# Altium schematic sheet 03-MCU.SchDoc: MCU
size A2; DocumentNumber: 3; SheetNumber: 3; SheetTotal: 15
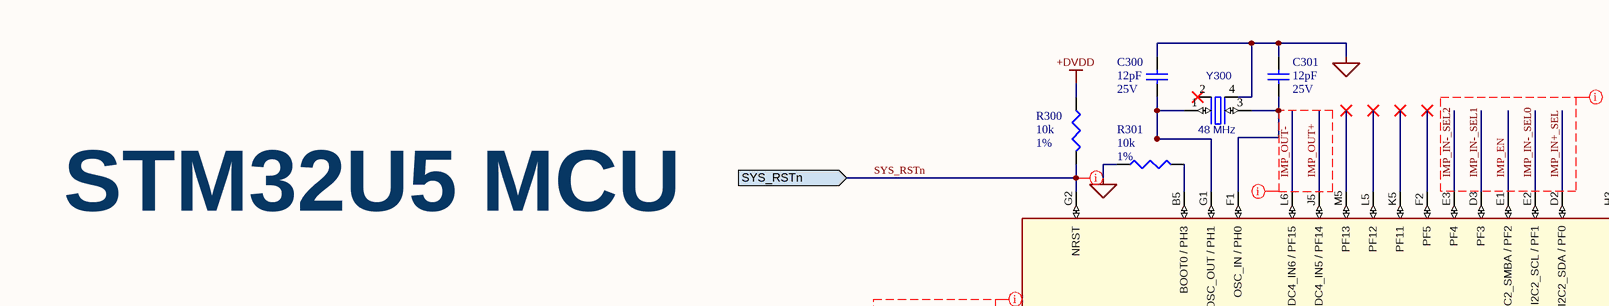
[diagram p0: 03-MCU.SchDoc, top left]
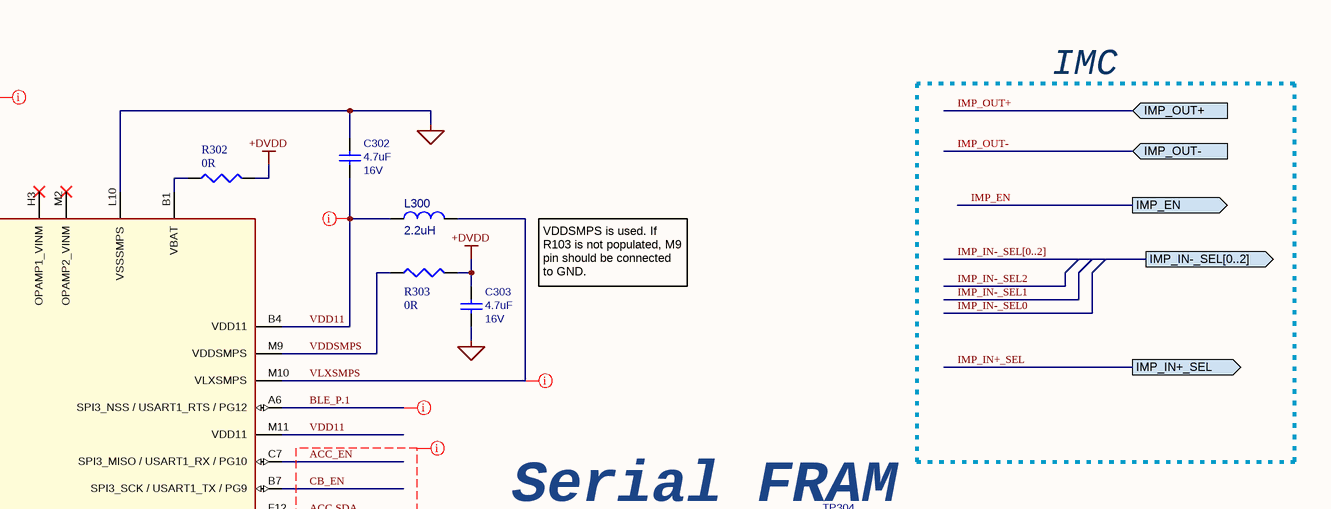
[diagram p1: 03-MCU.SchDoc, top right]
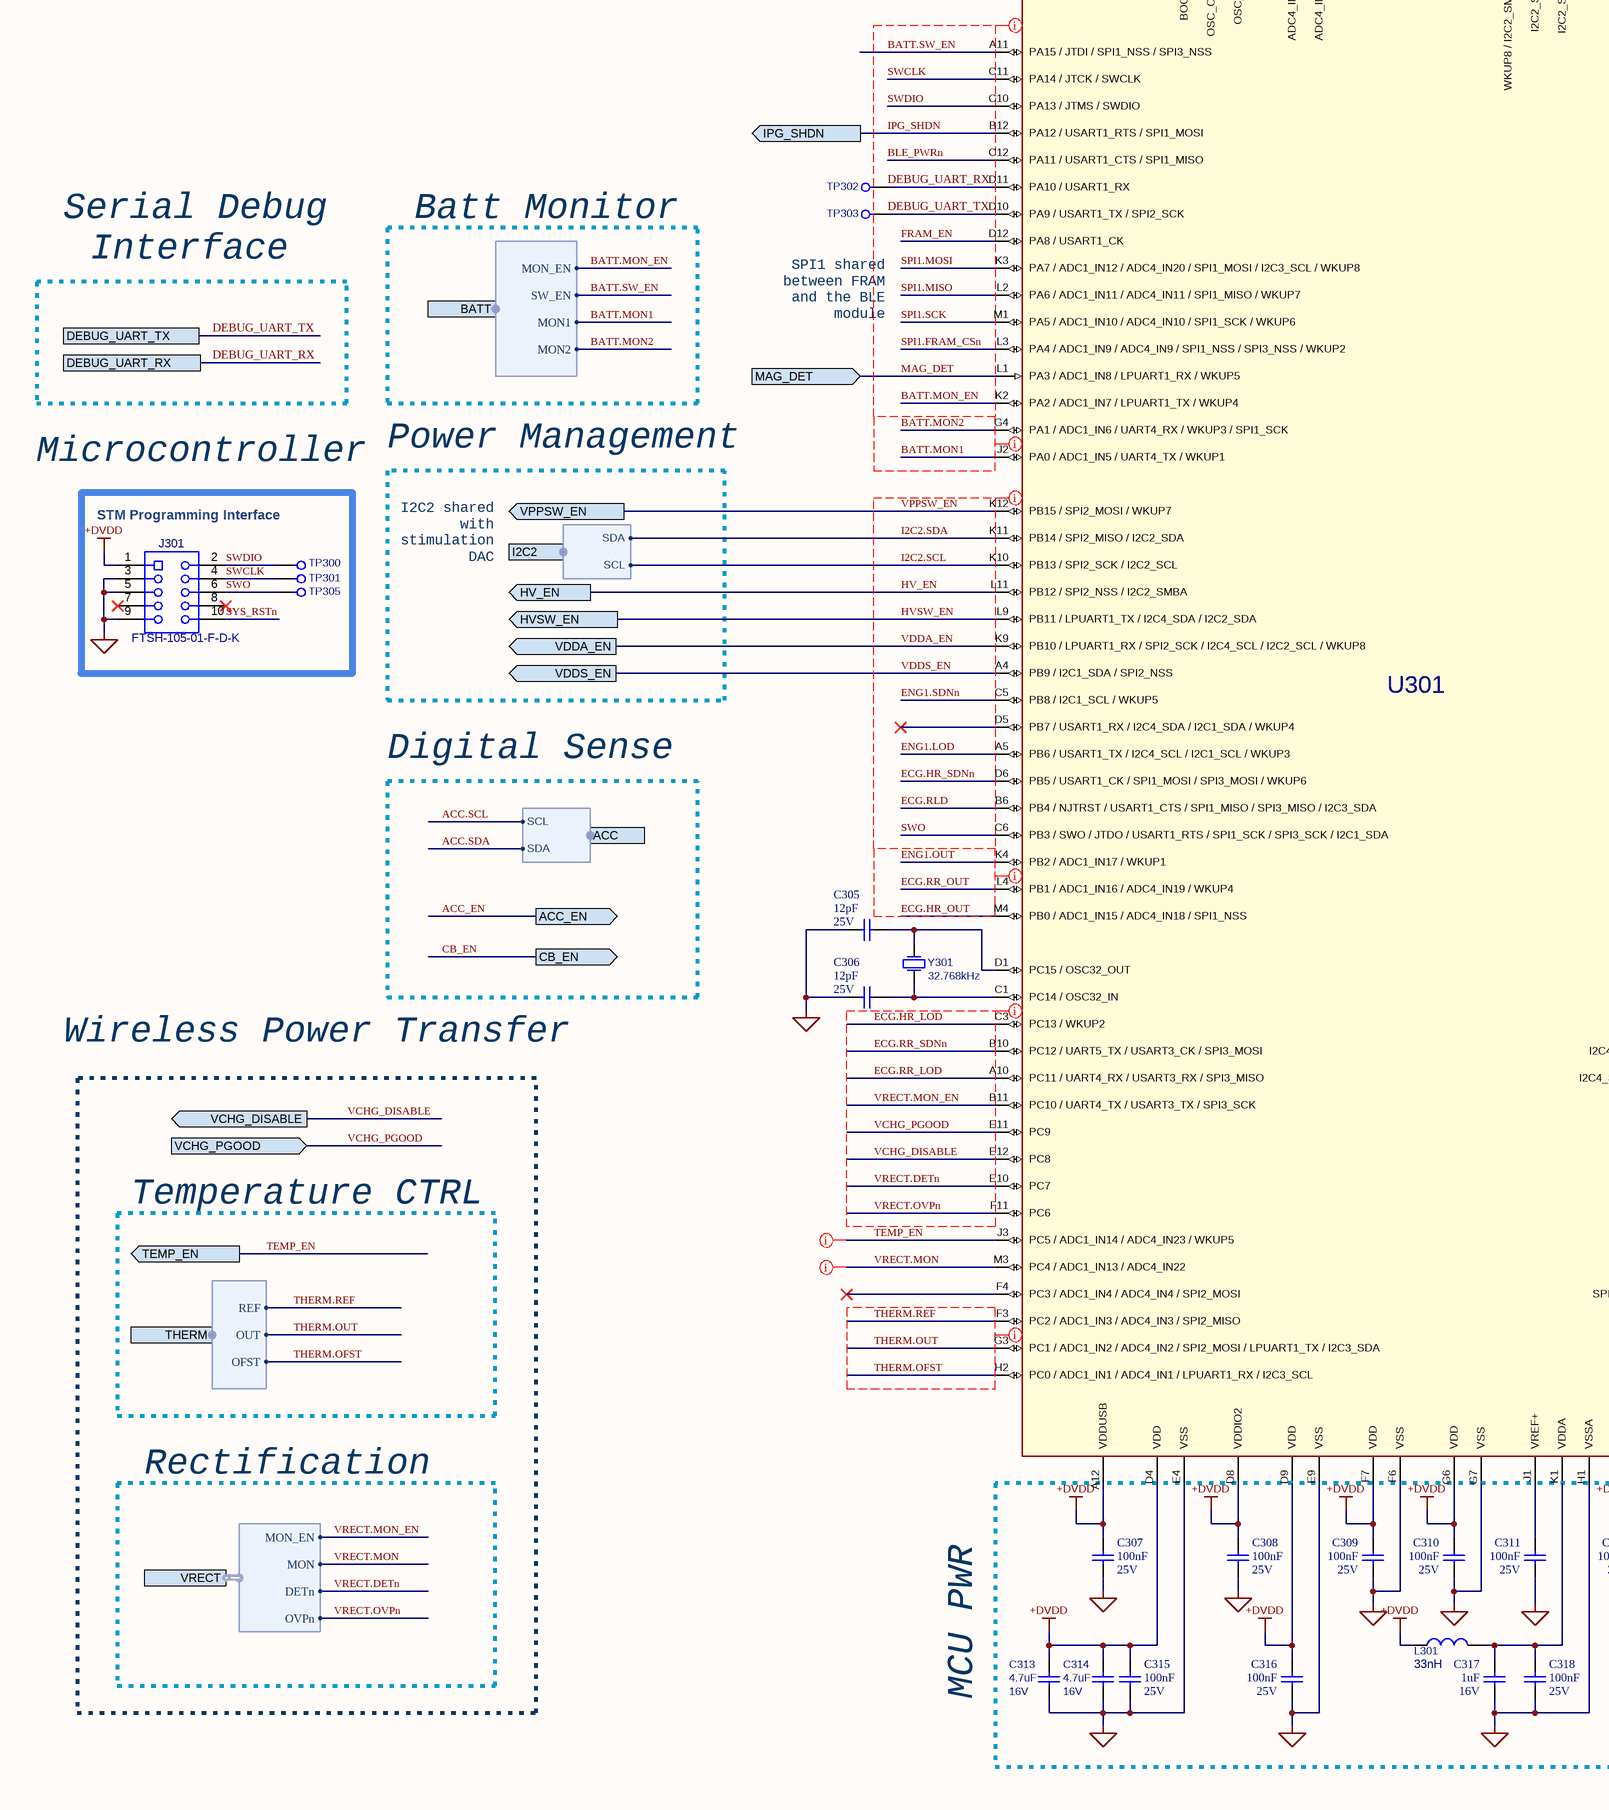
[diagram p2: 03-MCU.SchDoc, bottom left]
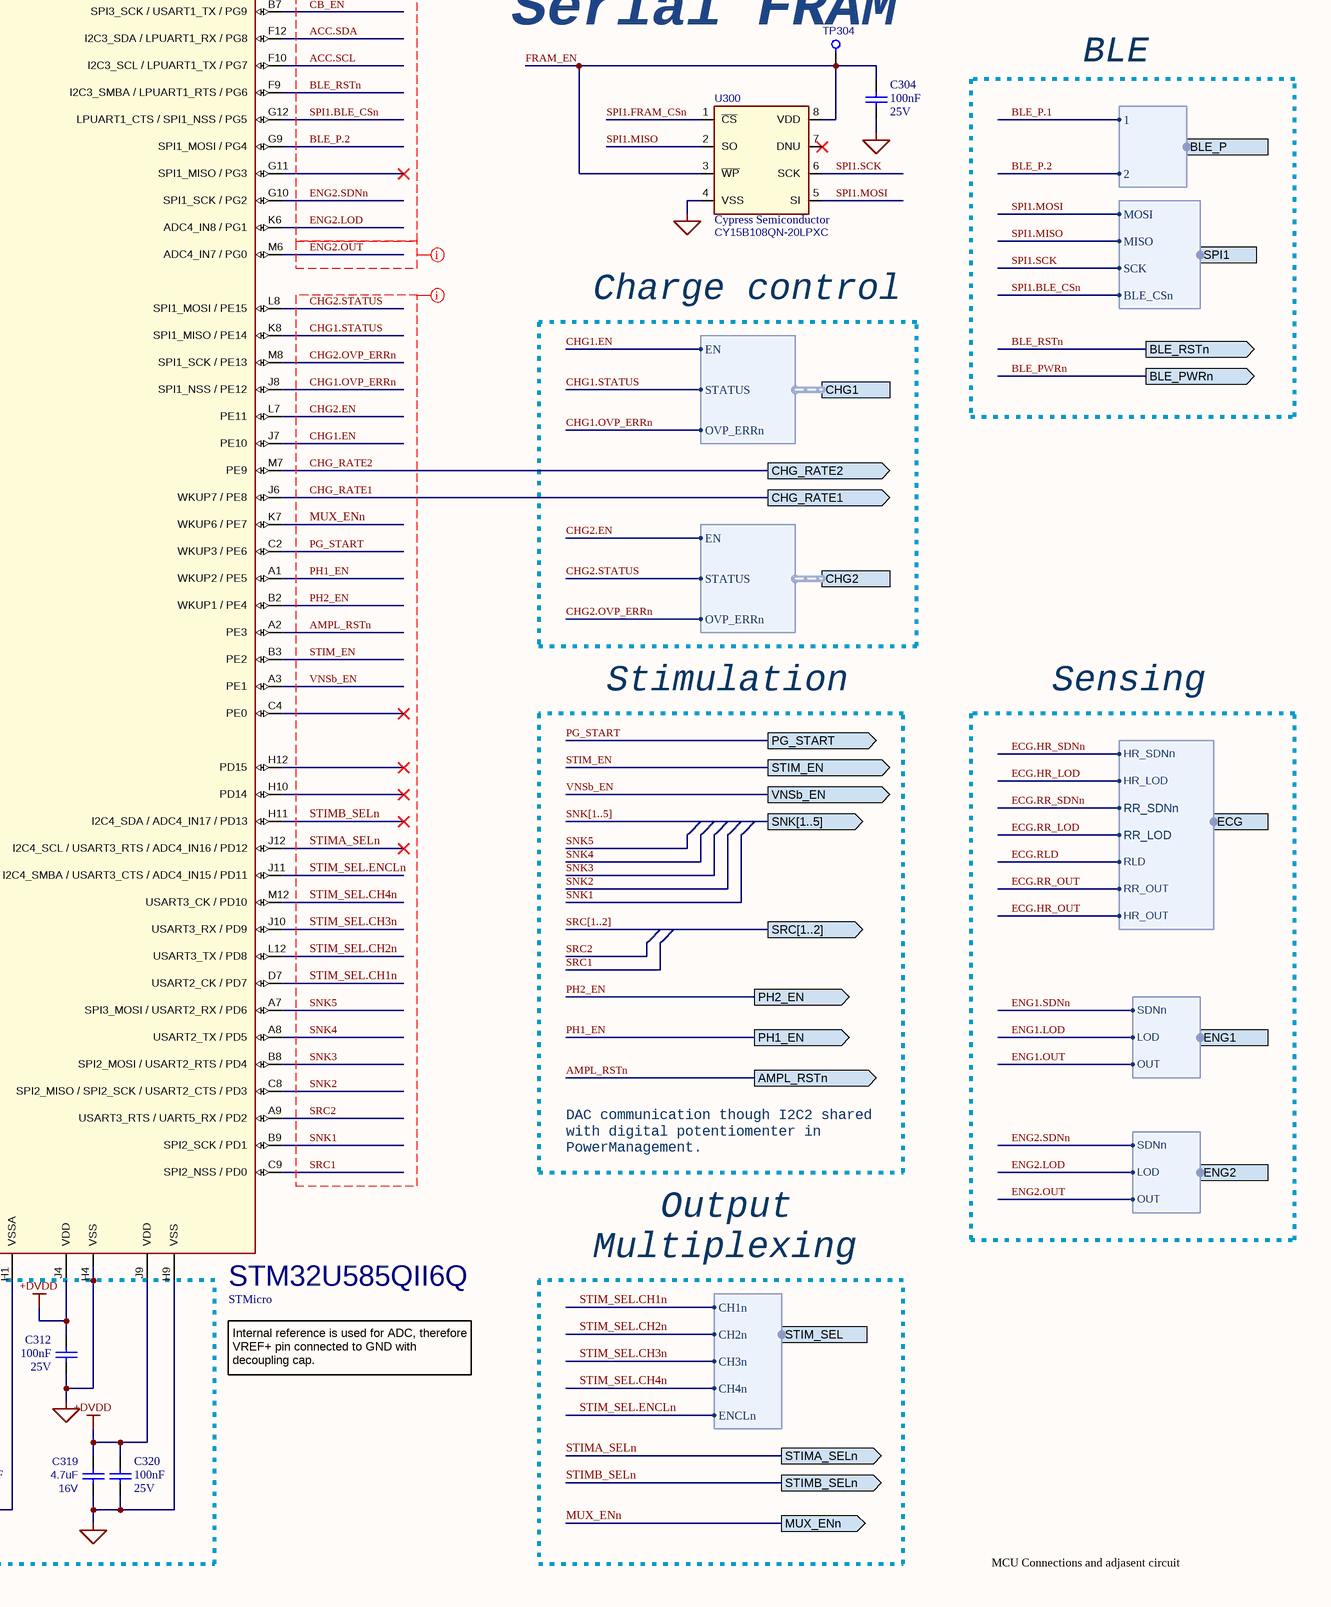
[diagram p3: 03-MCU.SchDoc, bottom right]

## Parts
C300  value 12pF  Rated DC Voltage (URdc): 25V  [C0201_C]  (hidden comment: GRM0335C1E120JA01D)
C301  value 12pF  Rated DC Voltage (URdc): 25V  [C0201_C]  (hidden comment: GRM0335C1E120JA01D)
C302  value 4.7uF  Rating: 16V  [CAP0603_REDUCED]  (hidden comment: GRM188R61C475KE11)
C303  value 4.7uF  Rating: 16V  [CAP0603_REDUCED]  (hidden comment: GRM188R61C475KE11)
C304  value 100nF  Rated DC Voltage (URdc): 25V  [C0201_C]  (hidden comment: GRM033R61E104KE14J)
C305  value 12pF  Rated DC Voltage (URdc): 25V  [C0201_C]  (hidden comment: GRM0335C1E120JA01D)
C306  value 12pF  Rated DC Voltage (URdc): 25V  [C0201_C]  (hidden comment: GRM0335C1E120JA01D)
C307  value 100nF  Rated DC Voltage (URdc): 25V  [C0201_C]  (hidden comment: GRM033R61E104KE14J)
C308  value 100nF  Rated DC Voltage (URdc): 25V  [C0201_C]  (hidden comment: GRM033R61E104KE14J)
C309  value 100nF  Rated DC Voltage (URdc): 25V  [C0201_C]  (hidden comment: GRM033R61E104KE14J)
C310  value 100nF  Rated DC Voltage (URdc): 25V  [C0201_C]  (hidden comment: GRM033R61E104KE14J)
C311  value 100nF  Rated DC Voltage (URdc): 25V  [C0201_C]  (hidden comment: GRM033R61E104KE14J)
C312  value 100nF  Rated DC Voltage (URdc): 25V  [C0201_C]  (hidden comment: GRM033R61E104KE14J)
C313  value 4.7uF  Rating: 16V  [CAP0603_REDUCED]  (hidden comment: GRM188R61C475KE11)
C314  value 4.7uF  Rating: 16V  [CAP0603_REDUCED]  (hidden comment: GRM188R61C475KE11)
C315  value 100nF  Rated DC Voltage (URdc): 25V  [C0201_C]  (hidden comment: GRM033R61E104KE14J)
C316  value 100nF  Rated DC Voltage (URdc): 25V  [C0201_C]  (hidden comment: GRM033R61E104KE14J)
C317  value 1uF  Rated DC Voltage (URdc): 16V  [C0201_C]  (hidden comment: GRM033R61C105ME15D)
C318  value 100nF  Rated DC Voltage (URdc): 25V  [C0201_C]  (hidden comment: GRM033R61E104KE14J)
C319  value 4.7uF  Rating: 16V  [CAP0603_REDUCED]  (hidden comment: GRM188R61C475KE11)
C320  value 100nF  Rated DC Voltage (URdc): 25V  [C0201_C]  (hidden comment: GRM033R61E104KE14J)
J301  FTSH-105-01-F-D-K  [SAMTEC_FTSH-105-01-XXX-D-K]
L300  value 2.2uH  [TDK_VLS252010HBX-1]  (hidden comment: VLS252010HBX-2R2M-1)
L301  value 33nH  [L0402_C]  (hidden comment: LQG15HS33NJ02D)
R300  value 10k  Tolerance: 1%  [R0201_C]  (hidden comment: CRCW020110K0FNED)
R301  value 10k  Tolerance: 1%  [R0201_C]  (hidden comment: CRCW020110K0FNED)
R302  value 0R  [R0201_C]  (hidden comment: CRCW02010000Z0ED)
R303  value 0R  [R0201_C]  (hidden comment: CRCW02010000Z0ED)
TP300  Test Point  [testpad_0.9mm]  (value not drawn)  (no BOM)
TP301  Test Point  [testpad_0.9mm]  (value not drawn)  (no BOM)
TP302  Test Point  [testpad_0.9mm]  (value not drawn)  (no BOM)
TP303  Test Point  [testpad_0.9mm]  (value not drawn)  (no BOM)
TP304  Test Point  [testpad_0.9mm]  (value not drawn)  (no BOM)
TP305  Test Point  [testpad_0.9mm]  (value not drawn)  (no BOM)
U300  Manufacturer: Cypress Semiconductor  [CY_002-18131_GQFN8]  (hidden comment: CY15B108QN-20LPXC)
U301  Manufacturer: STMicro  [STM_UFBGA132]  (hidden comment: STM32U585QII6Q)
Y300  value 48 MHz  [XTAL_ECS-SMD-CRYSTAL-10-48-CKY-TR]  (hidden comment: ECS-480-10-48-CKY-TR)
Y301  value 32.768kHz  [MICROCRYSTAL_CC8V-T1A]  (hidden comment: CM8V-T1A-32.768KHZ-6PF-20PPM-TA-QC)

## Ports
ACC (harness I2C), ACC_EN (out), AMPL_RSTn (out), BATT (harness BATT), BLE_P (harness BLE PINS), BLE_PWRn (out), BLE_RSTn (out), CB_EN (out), CHG1 (harness CHG_CTRL), CHG2 (harness CHG_CTRL), CHG_RATE1 (out), CHG_RATE2 (out), DEBUG_UART_RX, DEBUG_UART_TX, ECG (harness ECG), ENG1 (harness EMG), ENG2 (harness EMG), HV_EN (out), HVSW_EN (out), I2C2 (harness I2C), IMP_EN (out), IMP_IN+_SEL (out), IMP_IN-_SEL[0..2] (out), IMP_OUT+ (in), IMP_OUT- (in), IPG_SHDN (out), MAG_DET (in), MUX_ENn (out), PG_START (out), PH1_EN (out), PH2_EN (out), SNK[1..5] (out), SPI1 (harness BLE_SPI), SRC[1..2] (out), STIM_EN (out), STIM_SEL (in, harness STIM_SEL), STIMA_SELn (out), STIMB_SELn (out), SYS_RSTn (in), TEMP_EN (out), THERM (harness THERMAL CTRL), VCHG_DISABLE (out), VCHG_PGOOD (in), VDDA_EN (out), VDDS_EN (out), VNSb_EN (out), VPPSW_EN (out), VRECT (harness VRECT)

## Harnesses
BLE PINS: 1, 2
BLE_SPI: MOSI, MISO, BLE_CSn, SCK
BATT: MON_EN, SW_EN, MON1, MON2
CHG_CTRL: STATUS, OVP_ERRn, EN
I2C: SDA, SCL
ECG: HR_SDNn, RLD, HR_LOD, HR_OUT, RR_SDNn, RR_LOD, RR_OUT
THERMAL CTRL: REF, OUT, OFST
VRECT: OVPn, DETn, MON, MON_EN
EMG: SDNn, LOD, OUT
STIM_SEL: CH1n, CH2n, CH3n, CH4n, ENCLn

## Nets
+DVDD: C303.1 C307.2 C308.2 C309.2 C310.2 C312.2 C313.1 C314.1 C315.2 C316.2 C319.1 C320.2 J301.1 L301.1 R300.1 R302.2 R303.2 U301.A12(VDDUSB) U301.D4(VDD) U301.D8(VDDIO2) U301.D9(VDD) U301.F7(VDD) U301.G6(VDD) U301.J4(VDD) U301.J9(VDD)
GND: C300.1 C301.2 C302.1 C303.2 C304.1 C305.1 C306.1 C307.1 C308.1 C309.1 C310.1 C311.1 C312.1 C313.2 C314.2 C315.1 C316.1 C317.2 C318.1 C319.2 C320.1 J301.3 J301.5 J301.9 R301.1 U300.4(VSS) U301.E4(VSS) U301.E9(VSS) U301.F6(VSS) U301.G7(VSS) U301.H1(VSSA) U301.H4(VSS) U301.H9(VSS) U301.L10(VSSSMPS) Y300.4(GND)
ACC.SCL: U301.F10(I2C3_SCL_/_LPUART1_TX_/_PG7) ; port ACC.SCL
ACC.SDA: U301.F12(I2C3_SDA_/_LPUART1_RX_/_PG8) ; port ACC.SDA
ACC_EN: U301.C7(SPI3_MISO_/_USART1_RX_/_PG10) ; port ACC_EN
AMPL_RSTn: U301.A2(PE3) ; port AMPL_RSTn
BATT.MON1: U301.J2(PA0_/_ADC1_IN5_/_UART4_TX_/_WKUP1) ; port BATT.MON1
BATT.MON2: U301.G4(PA1_/_ADC1_IN6_/_UART4_RX_/_WKUP3_/_SPI1_SCK) ; port BATT.MON2
BATT.MON_EN: U301.K2(PA2_/_ADC1_IN7_/_LPUART1_TX_/_WKUP4) ; port BATT.MON_EN
BATT.SW_EN: U301.A11(PA15_/_JTDI_/_SPI1_NSS_/_SPI3_NSS) ; port BATT.SW_EN
BLE_P.1: U301.A6(SPI3_NSS_/_USART1_RTS_/_PG12) ; port BLE_P.1
BLE_P.2: U301.G9(SPI1_MOSI_/_PG4) ; port BLE_P.2
BLE_PWRn: U301.C12(PA11_/_USART1_CTS_/_SPI1_MISO) ; port BLE_PWRn
BLE_RSTn: U301.F9(I2C3_SMBA_/_LPUART1_RTS_/_PG6) ; port BLE_RSTn
CB_EN: U301.B7(SPI3_SCK_/_USART1_TX_/_PG9) ; port CB_EN
CHG1.EN: U301.J7(PE10) ; port CHG1.EN
CHG1.OVP_ERRn: U301.J8(SPI1_NSS_/_PE12) ; port CHG1.OVP_ERRn
CHG1.STATUS: U301.K8(SPI1_MISO_/_PE14) ; port CHG1.STATUS
CHG2.EN: U301.L7(PE11) ; port CHG2.EN
CHG2.OVP_ERRn: U301.M8(SPI1_SCK_/_PE13) ; port CHG2.OVP_ERRn
CHG2.STATUS: U301.L8(SPI1_MOSI_/_PE15) ; port CHG2.STATUS
CHG_RATE1: U301.J6(WKUP7_/_PE8) ; port CHG_RATE1
CHG_RATE2: U301.M7(PE9) ; port CHG_RATE2
DEBUG_UART_RX: TP302.1 U301.D11(PA10_/_USART1_RX) ; port DEBUG_UART_RX
DEBUG_UART_TX: TP303.1 U301.D10(PA9_/_USART1_TX_/_SPI2_SCK) ; port DEBUG_UART_TX
ECG.HR_LOD: U301.C3(PC13_/_WKUP2) ; port ECG.HR_LOD
ECG.HR_OUT: U301.M4(PB0_/_ADC1_IN15_/_ADC4_IN18_/_SPI1_NSS) ; port ECG.HR_OUT
ECG.HR_SDNn: U301.D6(PB5_/_USART1_CK_/_SPI1_MOSI_/_SPI3_MOSI_/_WKUP6) ; port ECG.HR_SDNn
ECG.RLD: U301.B6(PB4_/_NJTRST_/_USART1_CTS_/_SPI1_MISO_/_SPI3_MISO_/_I2C3_SDA) ; port ECG.RLD
ECG.RR_LOD: U301.A10(PC11_/_UART4_RX_/_USART3_RX_/_SPI3_MISO) ; port ECG.RR_LOD
ECG.RR_OUT: U301.L4(PB1_/_ADC1_IN16_/_ADC4_IN19_/_WKUP4) ; port ECG.RR_OUT
ECG.RR_SDNn: U301.B10(PC12_/_UART5_TX_/_USART3_CK_/_SPI3_MOSI) ; port ECG.RR_SDNn
ENG1.LOD: U301.A5(PB6_/_USART1_TX_/_I2C4_SCL_/_I2C1_SCL_/_WKUP3) ; port ENG1.LOD
ENG1.OUT: U301.K4(PB2_/_ADC1_IN17_/_WKUP1) ; port ENG1.OUT
ENG1.SDNn: U301.C5(PB8_/_I2C1_SCL_/_WKUP5) ; port ENG1.SDNn
ENG2.LOD: U301.K6(ADC4_IN8_/_PG1) ; port ENG2.LOD
ENG2.OUT: U301.M6(ADC4_IN7_/_PG0) ; port ENG2.OUT
ENG2.SDNn: U301.G10(SPI1_SCK_/_PG2) ; port ENG2.SDNn
FRAM_EN: C304.2 TP304.1 U300.3(~{WP}) U300.8(VDD) U301.D12(PA8_/_USART1_CK)
HV_EN: U301.L11(PB12_/_SPI2_NSS_/_I2C2_SMBA) ; port HV_EN
HVSW_EN: U301.L9(PB11_/_LPUART1_TX_/_I2C4_SDA_/_I2C2_SDA) ; port HVSW_EN
I2C2.SCL: U301.K10(PB13_/_SPI2_SCK_/_I2C2_SCL) ; port I2C2.SCL
I2C2.SDA: U301.K11(PB14_/_SPI2_MISO_/_I2C2_SDA) ; port I2C2.SDA
IMP_EN: U301.E1(WKUP8_/_I2C2_SMBA_/_PF2) ; port IMP_EN
IMP_IN+_SEL: U301.D2(I2C2_SDA_/_PF0) ; port IMP_IN+_SEL
IMP_IN-_SEL0: U301.E2(I2C2_SCL_/_PF1)
IMP_IN-_SEL1: U301.D3(PF3)
IMP_IN-_SEL2: U301.E3(PF4)
IMP_OUT+: U301.J5(ADC4_IN5_/_PF14) ; port IMP_OUT+
IMP_OUT-: U301.L6(ADC4_IN6_/_PF15) ; port IMP_OUT-
IPG_SHDN: U301.B12(PA12_/_USART1_RTS_/_SPI1_MOSI) ; port IPG_SHDN
MAG_DET: U301.L1(PA3_/_ADC1_IN8_/_LPUART1_RX_/_WKUP5) ; port MAG_DET
MUX_ENn: U301.K7(WKUP6_/_PE7) ; port MUX_ENn
PG_START: U301.C2(WKUP3_/_PE6) ; port PG_START
PH1_EN: U301.A1(WKUP2_/_PE5) ; port PH1_EN
PH2_EN: U301.B2(WKUP1_/_PE4) ; port PH2_EN
SNK1: U301.B9(SPI2_SCK_/_PD1)
SNK2: U301.C8(SPI2_MISO_/_SPI2_SCK_/_USART2_CTS_/_PD3)
SNK3: U301.B8(SPI2_MOSI_/_USART2_RTS_/_PD4)
SNK4: U301.A8(USART2_TX_/_PD5)
SNK5: U301.A7(SPI3_MOSI_/_USART2_RX_/_PD6)
SPI1.BLE_CSn: U301.G12(LPUART1_CTS_/_SPI1_NSS_/_PG5) ; port SPI1.BLE_CSn
SPI1.FRAM_CSn: U300.1(~{CS}) U301.L3(PA4_/_ADC1_IN9_/_ADC4_IN9_/_SPI1_NSS_/_SPI3_NSS_/_WKUP2)
SPI1.MISO: U300.2(SO) U301.L2(PA6_/_ADC1_IN11_/_ADC4_IN11_/_SPI1_MISO_/_WKUP7) ; port SPI1.MISO
SPI1.MOSI: U300.5(SI) U301.K3(PA7_/_ADC1_IN12_/_ADC4_IN20_/_SPI1_MOSI_/_I2C3_SCL_/_WKUP8) ; port SPI1.MOSI
SPI1.SCK: U300.6(SCK) U301.M1(PA5_/_ADC1_IN10_/_ADC4_IN10_/_SPI1_SCK_/_WKUP6) ; port SPI1.SCK
SRC1: U301.C9(SPI2_NSS_/_PD0)
SRC2: U301.A9(USART3_RTS_/_UART5_RX_/_PD2)
STIM_EN: U301.B3(PE2) ; port STIM_EN
STIM_SEL.CH1n: U301.D7(USART2_CK_/_PD7) ; port STIM_SEL.CH1n
STIM_SEL.CH2n: U301.L12(USART3_TX_/_PD8) ; port STIM_SEL.CH2n
STIM_SEL.CH3n: U301.J10(USART3_RX_/_PD9) ; port STIM_SEL.CH3n
STIM_SEL.CH4n: U301.M12(USART3_CK_/_PD10) ; port STIM_SEL.CH4n
STIM_SEL.ENCLn: U301.J11(I2C4_SMBA_/_USART3_CTS_/_ADC4_IN15_/_PD11) ; port STIM_SEL.ENCLn
STIMA_SELn: U301.J12(I2C4_SCL_/_USART3_RTS_/_ADC4_IN16_/_PD12) ; port STIMA_SELn
STIMB_SELn: U301.H11(I2C4_SDA_/_ADC4_IN17_/_PD13) ; port STIMB_SELn
SWCLK: J301.4 TP301.1 U301.C11(PA14_/_JTCK_/_SWCLK)
SWDIO: J301.2 TP300.1 U301.C10(PA13_/_JTMS_/_SWDIO)
SWO: J301.6 TP305.1 U301.C6(PB3_/_SWO_/_JTDO_/_USART1_RTS_/_SPI1_SCK_/_SPI3_SCK_/_I2C1_SDA)
SYS_RSTn: J301.10 R300.2 U301.G2(NRST) ; port SYS_RSTn
TEMP_EN: U301.J3(PC5_/_ADC1_IN14_/_ADC4_IN23_/_WKUP5) ; port TEMP_EN
THERM.OFST: U301.H2(PC0_/_ADC1_IN1_/_ADC4_IN1_/_LPUART1_RX_/_I2C3_SCL) ; port THERM.OFST
THERM.OUT: U301.G3(PC1_/_ADC1_IN2_/_ADC4_IN2_/_SPI2_MOSI_/_LPUART1_TX_/_I2C3_SDA) ; port THERM.OUT
THERM.REF: U301.F3(PC2_/_ADC1_IN3_/_ADC4_IN3_/_SPI2_MISO) ; port THERM.REF
VCHG_DISABLE: U301.E12(PC8) ; port VCHG_DISABLE
VCHG_PGOOD: U301.E11(PC9) ; port VCHG_PGOOD
VDD11: C302.2 L300.1 U301.B4(VDD11) U301.M11(VDD11)
VDDA_EN: U301.K9(PB10_/_LPUART1_RX_/_SPI2_SCK_/_I2C4_SCL_/_I2C2_SCL_/_WKUP8) ; port VDDA_EN
VDDS_EN: U301.A4(PB9_/_I2C1_SDA_/_SPI2_NSS) ; port VDDS_EN
VDDSMPS: R303.1 U301.M9(VDDSMPS)
VLXSMPS: L300.2 U301.M10(VLXSMPS)
VNSb_EN: U301.A3(PE1) ; port VNSb_EN
VPPSW_EN: U301.K12(PB15_/_SPI2_MOSI_/_WKUP7) ; port VPPSW_EN
VRECT.DETn: U301.E10(PC7) ; port VRECT.DETn
VRECT.MON: U301.M3(PC4_/_ADC1_IN13_/_ADC4_IN22) ; port VRECT.MON
VRECT.MON_EN: U301.B11(PC10_/_UART4_TX_/_USART3_TX_/_SPI3_SCK) ; port VRECT.MON_EN
VRECT.OVPn: U301.F11(PC6) ; port VRECT.OVPn
NetC300_2: C300.2 U301.G1(OSC_OUT_/_PH1) Y300.1(IN/OUT)
NetC301_1: C301.1 U301.F1(OSC_IN_/_PH0) Y300.3(OUT/IN)
NetC305_2: C305.2 U301.D1(PC15_/_OSC32_OUT) Y301.2
NetC306_2: C306.2 U301.C1(PC14_/_OSC32_IN) Y301.1
NetC311_2: C311.2 U301.J1(VREF+)
NetC317_1: C317.1 C318.2 L301.2 U301.K1(VDDA)
NetR301_2: R301.2 U301.B5(BOOT0_/_PH3)
NetR302_1: R302.1 U301.B1(VBAT)

Not connected (* = marked no-connect by the designer): J301 7* 8*; U300 7(DNU)*; U301 C4(PE0)* D5(PB7_/_USART1_RX_/_I2C4_SDA_/_I2C1_SDA_/_WKUP4)* F2(PF5)* F4(PC3_/_ADC1_IN4_/_ADC4_IN4_/_SPI2_MOSI)* G11(SPI1_MISO_/_PG3)* H3(OPAMP1_VINM)* H10(PD14)* H12(PD15)* K5(PF11)* L5(PF12)* M2(OPAMP2_VINM)* M5(PF13)*; Y300 2(NC)*

## Buses and harness runs
bus IMP_IN-_SEL[0..2] = port IMP_IN-_SEL[0..2]
bus SNK[1..5] = port SNK[1..5]
bus SRC[1..2] = port SRC[1..2]

## Layout directives
net class DIGITAL: ACC.SCL, ACC.SDA, ACC_EN, AMPL_RSTn, BATT.MON_EN, BATT.SW_EN, BLE_P.1, BLE_P.2, BLE_PWRn, BLE_RSTn, CB_EN, CHG1.EN, CHG1.OVP_ERRn, CHG1.STATUS, CHG2.EN, CHG2.OVP_ERRn, CHG2.STATUS, CHG_RATE1, CHG_RATE2, DEBUG_UART_RX, DEBUG_UART_TX, ECG.HR_LOD, ECG.HR_SDNn, ECG.RLD, ECG.RR_LOD, ECG.RR_SDNn, ENG1.LOD, ENG1.SDNn, ENG2.LOD, ENG2.SDNn, FRAM_EN, HV_EN, HVSW_EN, I2C2.SCL, I2C2.SDA, IMP_EN, IMP_IN+_SEL, IMP_IN-_SEL0, IMP_IN-_SEL1, IMP_IN-_SEL2, IPG_SHDN, MAG_DET, MUX_ENn, PG_START, PH1_EN, PH2_EN, SNK1, SNK2, SNK3, SNK4, SNK5, SPI1.BLE_CSn, SPI1.FRAM_CSn, SPI1.MISO, SPI1.MOSI, SPI1.SCK, SRC1, SRC2, STIM_EN, STIM_SEL.CH1n, STIM_SEL.CH2n, STIM_SEL.CH3n, STIM_SEL.CH4n, STIM_SEL.ENCLn, STIMA_SELn, STIMB_SELn, SWCLK, SWDIO, SWO, SYS_RSTn, TEMP_EN, VCHG_DISABLE, VCHG_PGOOD, VDDA_EN, VDDS_EN, VNSb_EN, VPPSW_EN, VRECT.DETn, VRECT.MON_EN, VRECT.OVPn
net class ANALOG: BATT.MON1, BATT.MON2, ECG.HR_OUT, ECG.RR_OUT, ENG1.OUT, ENG2.OUT, IMP_OUT+, IMP_OUT-, THERM.OFST, THERM.OUT, THERM.REF, VRECT.MON
rule Supply Nets [Voltage = 3.300]; net class POWER: VDD11, VLXSMPS

## Notes on the sheet
- IMC
- STM32U5 MCU
- VDDSMPS is used. If R103 is not populated, M9 pin should be connected to GND.
- Serial Debug
- Batt Monitor
- Interface
- (near TP304) Serial FRAM
- BLE
- (near TP303) SPI1 shared between FRAM and the BLE module
- Microcontroller
- Power Management
- STM Programming Interface
- Charge control
- I2C2 shared with stimulation DAC
- Digital Sense
- Stimulation
- Sensing
- Wireless Power Transfer
- Temperature CTRL
- DAC communication though I2C2 shared with digital potentiomenter in PowerManagement.
- Output
- Rectification
- Multiplexing
- Internal reference is used for ADC, therefore VREF+ pin connected to GND with decoupling cap.
- MCU PWR
- MCU Connections and adjasent circuit
- Project:
- Schematic:
- Design by:
- Date:
- Ver:
- .
- Comments:
- Reviewed by:

## Library data of the parts
C300 C301 C305 C306 = GRM0335C1E120JA01D: Ceramic Capacitor, Multilayer, Ceramic, 25V, 5% +Tol, 5% -Tol, C0G, 30ppm/Cel TC, 0.000012uF, Surface Mount, 0201; Manufacturer: Murata; Multilayer: Yes; Category: Ceramic Capacitors; Supplier: Digikey; Supplier Part Number: 490-3144-1-ND; Manufacturer Part Number: GRM0335C1E120JA01D; RoHS: Yes; Stock: 4384132; Pricing: 1=0,1, 10=0,011, 50=0,0062, 100=0,0048, 500=0,0036, 1000=0,00283, 2500=0,00258, 5000=0,00237 (USD); Mounting Technology: Surface Mount; Pins: 2; Dielectric Material: Ceramic; Package Shape: Rectangular; Case/Package: 0201; Terminal Finish: Nickel; Min Operating Temperature: -55°C; Max Operating Temperature: 125°C; Termination: Wraparound; JESD-609 Code: e3; Capacitor Type: Ceramic; Tolerance  (fill in as +-): 5%; Packaging: Tape and Reel; Tolerance (fill in as +-): 5%; Temperature Characteristics Code: C0G; Reach SVHC Compliant: Yes; RoHS Compliant: Yes; ComponentLink1URL: https://datasheet.ciiva.com:443/pdfs/VipMasterIC/IC/MURE/MURE-S-A0004347008/MURE-S-A0004348737-1.pdf?src-supplier=IHS+Markit; ComponentLink1Description: https://datasheet.ciiva.com:443/pdfs/VipMasterIC/IC/MURE/MURE-S-A0004347008/MURE-S-A0004348737-1.pdf?src-supplier=IHS+Markit; Supplier 1: Arrow Electronics; Supplier Part Number 1: GRM0335C1E120JA01D
C302 C303 C313 C314 C319 = GRM188R61C475KE11: Capacitor, 4.7uF, X5R, 16V, 10%, 0603, Implant-grade; Manufacturer: Murata; Medical Grade MFR PN: GCH188R61C475KE11; Length (mm): 1.60 ±0.10; Medical Grade MFR: Murata; PCB Footprint: cap0603_reduced; Thickness (mm): 0.80 ±0.10; Width (mm): 0.80 ±0.10; Category: Capacitor; Package Description: 0603; Check: *; Supplier 1: Arrow Electronics; Supplier Part Number 1: GRM188R61C475KE11D; Status: *; Review: *; Manufacturer Part Number: GRM188R61C475KE11
C304 C307-C312 C315 C316 C318 C320 = GRM033R61E104KE14J: Ceramic Capacitor, Multilayer, Ceramic, 25V, 10% +Tol, 10% -Tol, X5R, 15% TC, 0.1uF, Surface Mount, 0201; Manufacturer: Murata; Multilayer: Yes; Category: Ceramic Capacitors; Supplier: Digikey; Supplier Part Number: 490-14571-1-ND; Manufacturer Part Number: GRM033R61E104KE14J; RoHS: Yes; Stock: 1540851; Pricing: 1=0,1, 10=0,033, 50=0,0192, 100=0,0148, 500=0,01118, 1000=0,00878, 2500=0,00798, 5000=0,00734 (USD); Mounting Technology: Surface Mount; Pins: 2; Dielectric Material: Ceramic; Package Shape: Rectangular; Case/Package: 0201; Terminal Finish: Nickel; Min Operating Temperature: -55°C; Max Operating Temperature: 85°C; JESD-609 Code: e3; Capacitor Type: Ceramic; Tolerance  (fill in as +-): 10%; Package Style: SMTMeter; Packaging: Tape and Reel; Tolerance (fill in as +-): 10%; Temperature Characteristics Code: X5R; Termination: Wraparound; Length: 0.6mm; Width: 0.3mm; Height: 0.3mm; Reach SVHC Compliant: Yes; RoHS Compliant: Yes; ComponentLink1URL: https://psearch.en.murata.com:443/capacitor/product/GRM033R61E104KE14%23.pdf?src-supplier=IHS+Markit; ComponentLink1Description: https://psearch.en.murata.com:443/capacitor/product/GRM033R61E104KE14%23.pdf?src-supplier=IHS+Markit; ComponentLink2URL: http://www.mouser.com/ds/2/281/c02e-2905.pdf?src-supplier=Mouser; ComponentLink2Description: http://www.mouser.com/ds/2/281/c02e-2905.pdf?src-supplier=Mouser; ComponentLink3URL: http://search.murata.co.jp/Ceramy/image/img/A01X/G101/ENG/GRM033R61E104KE14-01.pdf?src-supplier=Digikey; ComponentLink3Description: http://search.murata.co.jp/Ceramy/image/img/A01X/G101/ENG/GRM033R61E104KE14-01.pdf?src-supplier=Digikey; ComponentLink4URL: https://search.murata.co.jp/Ceramy/image/img/A01X/G101/ENG/GRM033R61E104KE14-01.pdf?src-supplier=Digikey; ComponentLink4Description: https://search.murata.co.jp/Ceramy/image/img/A01X/G101/ENG/GRM033R61E104KE14-01.pdf?src-supplier=Digikey; Supplier 1: Arrow Electronics; Supplier Part Number 1: GRM033R61E104KE14J
C317 = GRM033R61C105ME15D: Ceramic Capacitor, Multilayer, Ceramic, 16V, 20% +Tol, 20% -Tol, X5R, 15% TC, 1uF, Surface Mount, 0201; Manufacturer: Murata; Category: Ceramic Capacitors; Supplier: Digikey; Supplier Part Number: 490-18654-1-ND; Manufacturer Part Number: GRM033R61C105ME15D; RoHS: No; Stock: 132893; Pricing: 1=0,16, 10=0,105, 50=0,0628, 100=0,0493, 500=0,03644, 1000=0,03017, 2500=0,02808, 5000=0,02569 (USD); Supplier 1: Avnet; Supplier Part Number 1: GRM033R61C105ME15D
J301 = FTSH-105-01-F-D-K: Connector, 1.27 mm, 2x5, Male, TH; Manufacturer: Samtec; Review: 020823; Value: FTSH-105-01-F-D-K; Supplier 1: Mouser; Supplier Part Number 1: 200-FTSH10501FDK; Status: Approved; Manufacturer Part Number: FTSH-105-01-F-D-K
L300 = VLS252010HBX-2R2M-1: Inductor, 2.2uH, 1.76A, 1008; Manufacturer: TDK; Review: 020823; Category: Inductor; Rating: 1.76A; Supplier 1: Arrow Electronics; Supplier Part Number 1: VLS252010HBX-2R2M-1; Status: Approved; Manufacturer Part Number: VLS252010HBX-2R2M-1
L301 = LQG15HS33NJ02D: Inductor, Unshielded, 33nH, 350mA, 0402; Manufacturer: Murata; Medical Grade MFR: TBD; Review: 020823; Category: Inductor; Length (mm): TBD; Medical Grade MFR PN: TBD; Thickness (mm): TBD; Width (mm): TBD; PCB Footprint: TBD; Supplier 1: Arrow Electronics; Supplier Part Number 1: LQG15HS33NJ02D; Status: Approved; Manufacturer Part Number: LQG15HS33NJ02D
R300 R301 = CRCW020110K0FNED: Fixed Resistor, Metal Glaze/thick Film, 0.05W, 10000ohm, 30V, 1% +/-Tol, 200ppm/Cel, Surface Mount, 0201; Manufacturer: Vishay; Medical Grade MFR: Mini-Systems; Medical Grade MFR PN: MWA96SM-1002F-NS62TR; Power: 50mW; Rated Temperature: 70°C; Temperature Coefficient: 200ppm/°C; Package Height: 0.23mm; Package Length: 0.6mm; Package Width: 0.3mm; Reference Standard: AEC-Q200; Category: Chip SMD Resistors; Supplier: Digikey; Supplier Part Number: 541-10.0KABCT-ND; Manufacturer Part Number: CRCW020110K0FNED; RoHS: Yes; Stock: 1011530; Pricing: 1=0,1, 10=0,037, 50=0,0242, 100=0,0204, 500=0,01426, 1000=0,01241, 5000=0,00924 (USD); Mounting Technology: Surface Mount; Pins: 2; Package Shape: Rectangular; Case/Package: 0201; Terminal Finish: Nickel; Min Operating Temperature: -55°C; Max Operating Temperature: 155°C; JESD-609 Code: e3; Resistor Type: FIXED RESISTOR; Construction: Chip; Package Style: SMTMeter; Packaging: Tape and Reel; Technology: METAL GLAZE/THICK FILM; Termination: Wraparound; Working Voltage: 30V; Reach SVHC Compliant: Yes; RoHS Compliant: Yes; ComponentLink1URL: https://datasheet.ciiva.com:443/pdfs/VipMasterIC/IC/VISH/VISH-S-A0002932828/VISH-S-A0002932828-1.pdf?src-supplier=IHS+Markit; ComponentLink1Description: https://datasheet.ciiva.com:443/pdfs/VipMasterIC/IC/VISH/VISH-S-A0002932828/VISH-S-A0002932828-1.pdf?src-supplier=IHS+Markit; ComponentLink2URL: https://datasheet.ciiva.com/2474/crcw0201e3-2474819.pdf?src-supplier=Digikey; ComponentLink2Description: https://datasheet.ciiva.com/2474/crcw0201e3-2474819.pdf?src-supplier=Digikey; ComponentLink3URL: https://datasheet.ciiva.com/2474/crcw0201e3-2474820.pdf?src-supplier=Digikey; ComponentLink3Description: https://datasheet.ciiva.com/2474/crcw0201e3-2474820.pdf?src-supplier=Digikey; ComponentLink4URL: https://datasheet.ciiva.com/2474/crcw0201e3-2474818.pdf?src-supplier=Digikey; ComponentLink4Description: https://datasheet.ciiva.com/2474/crcw0201e3-2474818.pdf?src-supplier=Digikey; ComponentLink5URL: https://datasheet.ciiva.com/16436/dcrcwe3-16436222.pdf?src-supplier=Future+Electronics; ComponentLink5Description: https://datasheet.ciiva.com/16436/dcrcwe3-16436222.pdf?src-supplier=Future+Electronics; ComponentLink6URL: https://datasheet.ciiva.com/7983/1719906-7983320.pdf?src-supplier=Element14; ComponentLink6Description: https://datasheet.ciiva.com/7983/1719906-7983320.pdf?src-supplier=Element14; ComponentLink7URL: https://datasheet.ciiva.com/7983/1719906-7983319.pdf?src-supplier=Element14; ComponentLink7Description: https://datasheet.ciiva.com/7983/1719906-7983319.pdf?src-supplier=Element14; ComponentLink8URL: https://datasheet.ciiva.com/22692/1719906-22692709.pdf?src-supplier=Element14; ComponentLink8Description: https://datasheet.ciiva.com/22692/1719906-22692709.pdf?src-supplier=Element14; Supplier 1: Mouser; Supplier Part Number 1: 71-CRCW0201-10K
R302 R303 = CRCW02010000Z0ED: Fixed Resistor, Metal Glaze/thick Film, 0.05W, 0ohm, Surface Mount, 0201; Manufacturer: Vishay; Medical Grade MFR: Mini-Systems; Medical Grade MFR PN: MWA96SM-0000F-NS62TR; Power: 50mW; Rated Temperature: 70°C; Package Height: 0.23mm; Package Length: 0.6mm; Package Width: 0.3mm; Reference Standard: AEC-Q200; Category: Chip SMD Resistors; Supplier: Digikey; Supplier Part Number: 541-0.0AGCT-ND; Manufacturer Part Number: CRCW02010000Z0ED; RoHS: Yes; Stock: 701366; Pricing: 1=0,1, 10=0,034, 25=0,026, 50=0,0198, 100=0,0138, 250=0,01112, 500=0,0089, 1000=0,00655, 5000=0,0047 (USD); Mounting Technology: Surface Mount; Pins: 2; Package Shape: Rectangular; Case/Package: 0201; Terminal Finish: Nickel; Min Operating Temperature: -55°C; Max Operating Temperature: 155°C; JESD-609 Code: e3; Resistor Type: FIXED RESISTOR; Construction: Chip; Package Style: SMTMeter; Packaging: Tape and Reel; Technology: METAL GLAZE/THICK FILM; Termination: Wraparound; Reach SVHC Compliant: Yes; RoHS Compliant: Yes; ComponentLink1URL: https://datasheet.ciiva.com:443/pdfs/VipMasterIC/IC/VISH/VISH-S-A0002932828/VISH-S-A0002932828-1.pdf?src-supplier=IHS+Markit; ComponentLink1Description: https://datasheet.ciiva.com:443/pdfs/VipMasterIC/IC/VISH/VISH-S-A0002932828/VISH-S-A0002932828-1.pdf?src-supplier=IHS+Markit; ComponentLink2URL: https://datasheet.ciiva.com/2471/crcw0201e3-2471712.pdf?src-supplier=Digikey; ComponentLink2Description: https://datasheet.ciiva.com/2471/crcw0201e3-2471712.pdf?src-supplier=Digikey; ComponentLink3URL: https://datasheet.ciiva.com/7841/1719906-7841431.pdf?src-supplier=Element14; ComponentLink3Description: https://datasheet.ciiva.com/7841/1719906-7841431.pdf?src-supplier=Element14; ComponentLink4URL: https://datasheet.ciiva.com/7841/1719906-7841430.pdf?src-supplier=Element14; ComponentLink4Description: https://datasheet.ciiva.com/7841/1719906-7841430.pdf?src-supplier=Element14; ComponentLink5URL: https://datasheet.ciiva.com/22665/1847332-22665688.pdf?src-supplier=Element14; ComponentLink5Description: https://datasheet.ciiva.com/22665/1847332-22665688.pdf?src-supplier=Element14; ComponentLink6URL: https://datasheet.ciiva.com/2471/crcw0201e3-2471713.pdf?src-supplier=Digikey; ComponentLink6Description: https://datasheet.ciiva.com/2471/crcw0201e3-2471713.pdf?src-supplier=Digikey; ComponentLink7URL: https://datasheet.ciiva.com/2471/crcw0201e3-2471711.pdf?src-supplier=Digikey; ComponentLink7Description: https://datasheet.ciiva.com/2471/crcw0201e3-2471711.pdf?src-supplier=Digikey; ComponentLink8URL: https://datasheet.ciiva.com/16757/70202042-16757849.pdf?src-supplier=Allied+Electronics; ComponentLink8Description: https://datasheet.ciiva.com/16757/70202042-16757849.pdf?src-supplier=Allied+Electronics; ComponentLink9URL: https://datasheet.ciiva.com/16436/crcw0201e3-16436237.pdf?src-supplier=Future+Electronics; ComponentLink9Description: https://datasheet.ciiva.com/16436/crcw0201e3-16436237.pdf?src-supplier=Future+Electronics; Supplier 1: Digikey; Supplier Part Number 1: 541-0.0AGDKR-ND
TP300-TP305 = Test Point: Test pad, 0.90mm circular pad; PCB Footprint: testpad_0p90mm; Length (mm): 0.90; Manufacturer: N/A; Manufacturer PN: N/A; Medical Grade MFR: N/A; Medical Grade MFR PN: N/A; Rating: N/A; Thickness (mm): N/A; Value: Test point; Width (mm): 0.90; Category: Test point; Status: *; Review: *
U300 = CY15B108QN-20LPXC: FRAM, 8 Mbit (1024k x 8), SPI, 1.8-3.6V, QFN-8; Medical Grade MFR: TBD; Rating: 3.6V; Category: IC; Length (mm): 3.28 ±0.05; Medical Grade MFR PN: TBD; PCB Footprint: TBD; Thickness (mm): 0.50 ±0.05; Value: CY15B108QN-20LPXC; Width (mm): 3.23 ±0.05; Package Description: TBD; Supplier 1: Heisener; Supplier Part Number 1: CY15B108QN-20LPXC; Status: *; Review: *; Manufacturer Part Number: CY15B108QN-20LPXC
U301 = STM32U585QII6Q: Microcontroller, ARM Cortex-M33, 2.0 MB Flash, 786 kB RAM, BGA-132 pins with dedicated pinout supporting SMPS step-down converter; Medical Grade MFR: TBD; Category: IC; Length (mm): 7.00 ±0.15; Medical Grade MFR PN: TBD; Package Description: TBD; PCB Footprint: TBD; Rating: TBD; Thickness (mm): 0.60; Width (mm): 7.00 ±0.15; Supplier 1: Mouser; Supplier Part Number 1: 511-STM32U585QII6Q; Status: *; Review: *; Value: STM32U585QII6Q; Manufacturer Part Number: STM32U585QII6Q
Y300 = ECS-480-10-48-CKY-TR: 48 MHz Â±10ppm Crystal 10pF 100 Ohms 4-SMD, No Lead; Manufacturer: ECS Inc.; Medical Grade MFR: TBD; Category: Crystal; Length (mm): 1.20; Medical Grade MFR PN: TBD; PCB Footprint: TBD; Rating: N/A; Thickness (mm): 0.33; Width (mm): 1.00; Package Description: 4-SMD, No Lead; Supplier 1: Digi-Key; Supplier Part Number 1: XC3037CT-ND; Status: *; Review: *; Manufacturer Part Number: ECS-480-10-48-CKY-TR
Y301 = CM8V-T1A-32.768KHZ-6PF-20PPM-TA-QC: CRYSTAL 32.7680KHZ 6PF SMD; Manufacturer: Micro Crystal; Medical Grade MFR PN: CC8V-T1A32.768kHz6.0pF±20ppmTAQM; PCB Footprint: TBD; Review: 020823; Category: Crystal; Length (mm): 2.00; Medical Grade MFR: Micro Crystal; Rating: N/A; Thickness (mm): 0.67; Width (mm): 1.20; Package Description: CC8V; Supplier 1: Digi-Key; Supplier Part Number 1: 2195-CM8V-T1A-32.768KHZ-6PF-20PPM-TA-QCCT-ND; Status: Approved; Manufacturer Part Number: CM8V-T1A-32.768KHZ-6PF-20PPM-TA-QC